# Altium schematic sheet Charlotte5822_32-Channel-Wireless-Headstage__PCB_AltiumDesigner_IntanRHD2132_Schematic1__1_P1.schdoc
size 309 x 223 mm; Symbol: sheet-symbol_a4; Device: Sheet-Symbol_A4; Company: 嘉立创EDA; Version: V1.0; Page Size: A4; @Project Name: 7SPI_BX; @Page Count: 1; @Update Date: 2024-09-04; @Create Date: 2024-09-04; @Schematic Name: Schematic1; @Page No: 1; @Page Name: P1
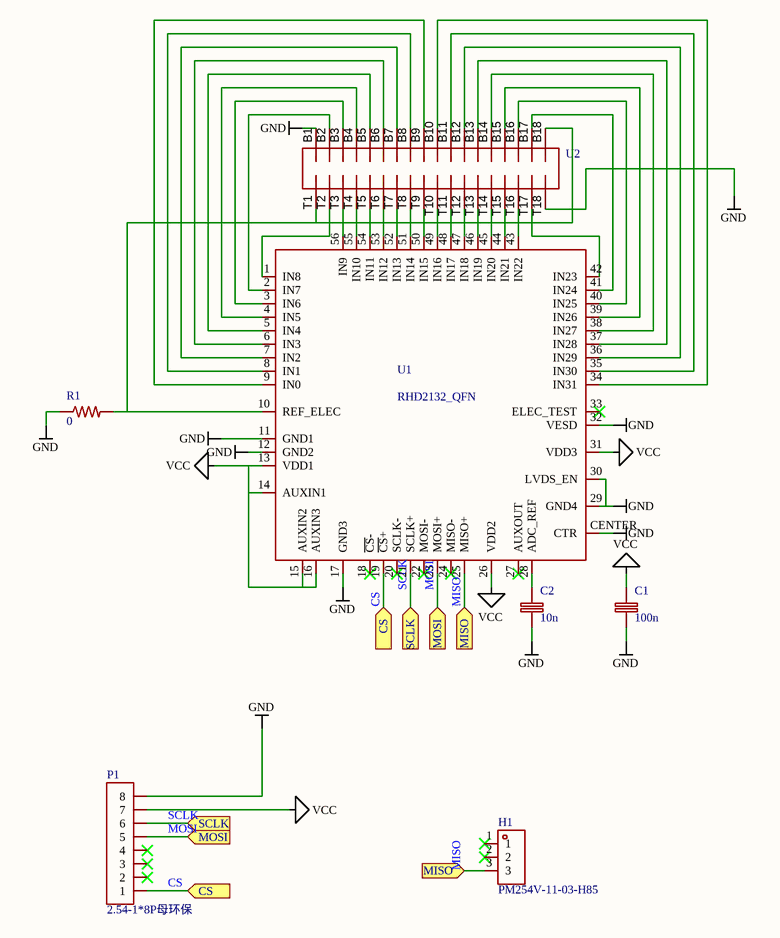
[diagram p0: Charlotte5822_32-Channel-Wireless-Headstage__PCB_AltiumDesigner_IntanRHD2132_Schematic1__1_P1.schdoc]

## Parts
C1  100n  [0402]  (value not drawn)
C2  10n  [0402]  (value not drawn)
H1  PM254V-11-03-H85  [HDR-TH_3P-P2.54-V-F]  (value not drawn)
P1  2.54-1*8P母环保  [HDR-TH_8P-P2.54-V-F-1]  (value not drawn)
R1  0  [0402]  (value not drawn)
U1  RHD2132_QFN  [QFN56_8_X_8_LARGE]  (value not drawn)
U2  OMNETICS_A79027  [OMNETICS_A79027]  (value not drawn)

## Ports
CS (in), MISO (in), MOSI (in), SCLK (in)

## Nets
GND: C1.2 C2.2 P1.8 R1.1 U1.11(GND1) U1.12(GND2) U1.17(GND3) U1.29(GND4) U1.30(LVDS_EN) U1.32(VESD) U1.CENTER(CTR) U2.B1 U2.T18
VCC: C1.1 P1.7 U1.13(VDD1) U1.14(AUXIN1) U1.15(AUXIN2) U1.16(AUXIN3) U1.26(VDD2) U1.31(VDD3)
CS: P1.1 U1.19(~{CS}+) ; port CS
MISO: H1.3 U1.25(MISO+) ; port MISO
MOSI: P1.5 U1.23(MOSI+) ; port MOSI
SCLK: P1.6 U1.21(SCLK+) ; port SCLK
NetC2_1: C2.1 U1.28(ADC_REF)
NetR1_2: R1.2 U1.10(REF_ELEC) U2.B18 U2.T1
NetU1_1: U1.1(IN8) U2.T2
NetU1_2: U1.2(IN7) U2.B2
NetU1_3: U1.3(IN6) U2.B3
NetU1_4: U1.4(IN5) U2.B4
NetU1_5: U1.5(IN4) U2.B5
NetU1_6: U1.6(IN3) U2.B6
NetU1_7: U1.7(IN2) U2.B7
NetU1_8: U1.8(IN1) U2.B8
NetU1_9: U1.9(IN0) U2.B9
NetU1_34: U1.34(IN31) U2.B10
NetU1_35: U1.35(IN30) U2.B11
NetU1_36: U1.36(IN29) U2.B12
NetU1_37: U1.37(IN28) U2.B13
NetU1_38: U1.38(IN27) U2.B14
NetU1_39: U1.39(IN26) U2.B15
NetU1_40: U1.40(IN25) U2.B16
NetU1_41: U1.41(IN24) U2.B17
NetU1_42: U1.42(IN23) U2.T17
NetU1_43: U1.43(IN22) U2.T16
NetU1_44: U1.44(IN21) U2.T15
NetU1_45: U1.45(IN20) U2.T14
NetU1_46: U1.46(IN19) U2.T13
NetU1_47: U1.47(IN18) U2.T12
NetU1_48: U1.48(IN17) U2.T11
NetU1_49: U1.49(IN16) U2.T10
NetU1_50: U1.50(IN15) U2.T9
NetU1_51: U1.51(IN14) U2.T8
NetU1_52: U1.52(IN13) U2.T7
NetU1_53: U1.53(IN12) U2.T6
NetU1_54: U1.54(IN11) U2.T5
NetU1_55: U1.55(IN10) U2.T4
NetU1_56: U1.56(IN9) U2.T3

Not connected (* = marked no-connect by the designer): H1 1* 2*; P1 2* 3* 4*; U1 18(~{CS}-)* 20(SCLK-)* 22(MOSI-)* 24(MISO-)* 27(AUXOUT)* 33(ELEC_TEST)*

## Notes on the sheet
- 1
- 2
- 3
- 4
- 5
- 6
- A
- B
- C
- 原理图
- Schematic1
- 创建日期
- 更新日期
- 2024-09-04
- D
- 审阅
- 绘制
- 图页
- P1
- 物料编码
- 7SPI_BX
- 版本
- 尺寸
- 页
- 共
- V1.0
- A4
- 嘉立创EDA

## Library data of the parts
C1 C2 = RHD2000_eval_board_C__0402: Add into BOM: yes; Symbol: RHD2000_eval_board_C__0402; Device: RHD2000_eval_board_C__0402; Convert to PCB: yes; Origin Footprint: 0402
H1 = PM254V-11-03-H85: 插孔结构:1x3P;间距:2.54mm;行距:-;安装类型:直插;排数:单排;总孔位数:3P;塑高:-;触头材质:黄铜;触头镀层:-;; Manufacturer: XFCN(兴飞); Add into BOM: yes; Holes Structure: 1x3P; Pitch: 2.54mm; Number of Holes: 3P; Symbol: PM254V-11-03-H85; Device: PM254V-11-03-H85; LCSC Part Name: 间距:2.54mm 1x3P 直插; Supplier Part: C541850; Manufacturer Part: PM254V-11-03-H85; Supplier Footprint: 插件,P=2.54mm; JLCPCB Part Class: 扩展库; Datasheet: https://atta.szlcsc.com/upload/public/pdf/source/20200518/C541849_85853D71FC67C51915A806977A588FDA.pdf; Supplier: LCSC; Convert to PCB: yes; Row Spacing: -; Mounting Type: 直插; Number of Rows: 单排; Insulation Height: -; Contact Material: 黄铜; Contact Plating: -
P1 = 2.54-1*8P母环保: 插孔结构:1x8P;间距:2.54mm;行距:-;安装类型:直插;排数:单排;总孔位数:8P;塑高:-;触头材质:-;触头镀层:-;; Manufacturer: BOOMELE(博穆精密); Symbol: Header-Female-2.54_1x8; Add into BOM: yes; Holes Structure: 1x8P; Pitch: 2.54mm; Number of Holes: 8P; Device: 2.54-1*8P母环保; Supplier: LCSC; Manufacturer Part: 2.54-1*8P母环保; Supplier Part: C27438; JLCPCB Part Class: 扩展库; LCSC Part Name: 间距:2.54mm 1x8P 直插; Supplier Footprint: 插件,P=2.54mm; Datasheet: https://atta.szlcsc.com/upload/public/pdf/source/20231221/1CA800C6799ED97958773716FAA1BFFE.pdf; Convert to PCB: yes; Row Spacing: -; Mounting Type: 直插; Number of Rows: 单排; Insulation Height: -; Contact Material: -; Contact Plating: -
R1 = RHD2000_eval_board_R__0402: Add into BOM: yes; Symbol: RHD2000_eval_board_R__0402; Device: RHD2000_eval_board_R__0402; Convert to PCB: yes; Origin Footprint: 0402
U1 = RHD2000_RHD2132__QFN: Add into BOM: yes; Symbol: RHD2000_RHD2132__QFN; Device: RHD2000_RHD2132__QFN; Convert to PCB: yes; Origin Footprint: QFN56_8_X_8_LARGE
U2 = OMNETICS_A79027: Convert to PCB: yes; Symbol: OMNETICS_A79027; Device: OMNETICS_A79027; Add into BOM: yes